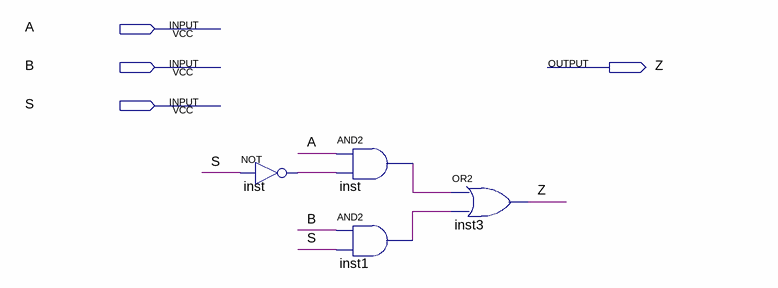
[diagram p0: schematic sheet]
// Quartus schematic MUX2_1.bdf as structural Verilog: 4 symbols, 4 pins
module MUX2_1 (
  input  A,
  input  B,
  input  S,
  output Z
);

  wire inst1_out, inst_out, inst_out_2;

  not inst (inst_out, S);
  and inst_dup2 (inst_out_2, A, inst_out);
  and inst1 (inst1_out, B, S);
  or inst3 (Z, inst_out_2, inst1_out);
endmodule
